# EAGLE design TapuinoMini (EAGLE 6.6.0)
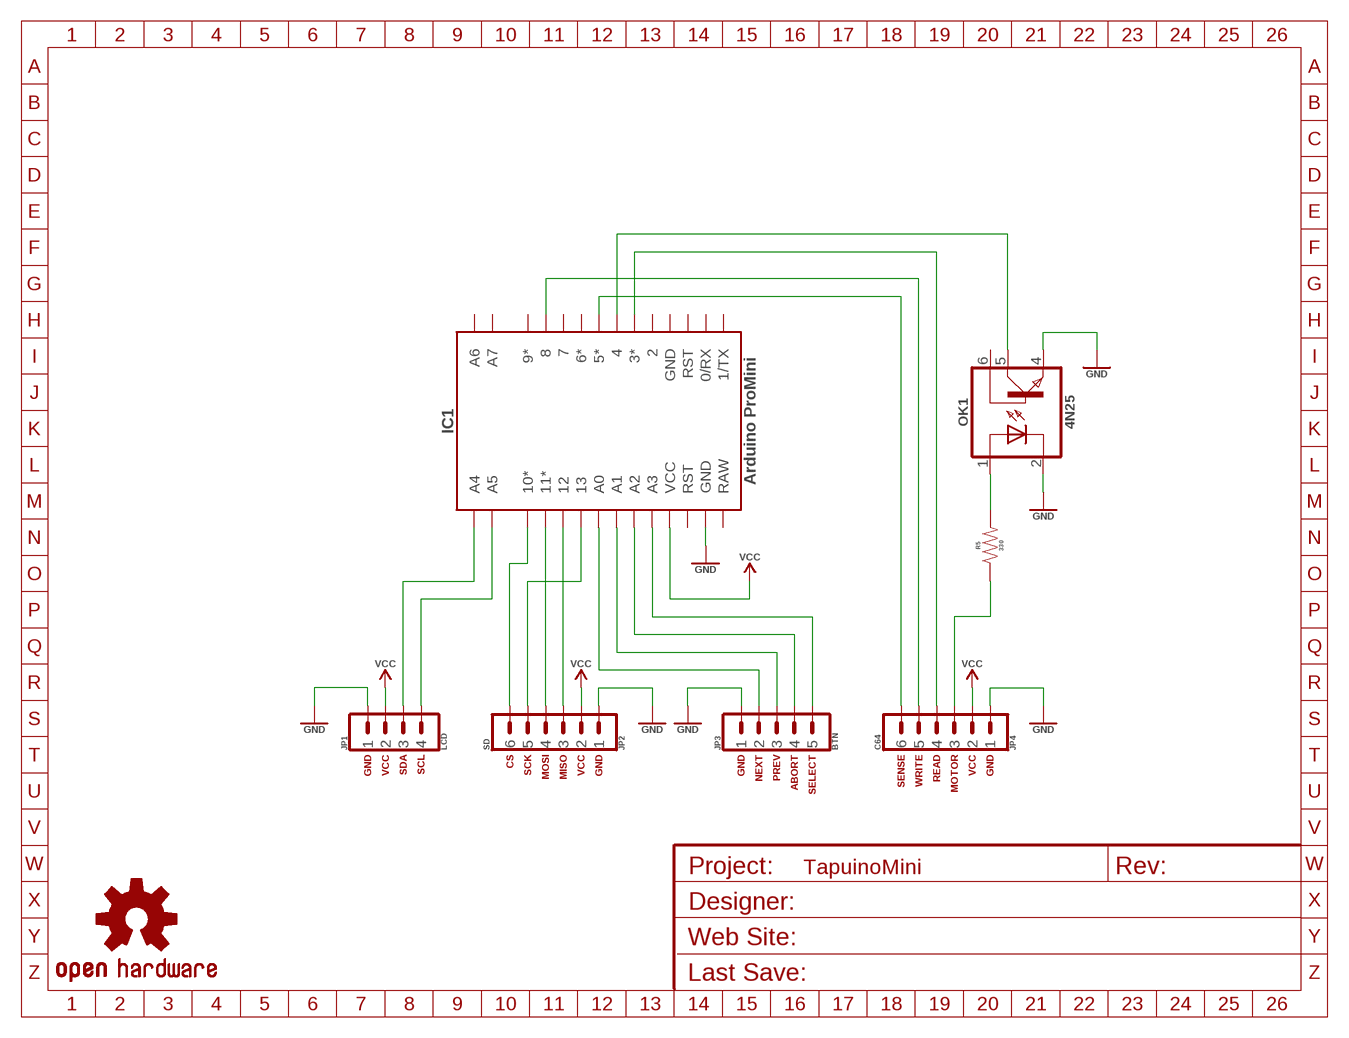
[diagram p0: schematic, sheet 1]
U$1 (FRAME_A5L): DESIGNER: Özay Turay a.k.a Simon/CGTr; REVISION: A 1.01; WEBSITE: http://www.commodore.gen.tr

## Parts
IC1  Arduino ProMini  PROMINI_A  [PROMINI_A]
JP1  LCD  1X04_SQR  [1X04_SQR]
JP2  SD  1X06_SQR  [1X06_SQR]
JP3  BTN  1X05_SQR  [1X05_SQR]
JP4  C64  1X06_SQR  [1X06_SQR]
LOGO1  OSHW-LOGOL  [OSHW-LOGO-L]
OK1  4N25  OPTO_6PIN_4NXX  [DIP06]
R5  330  RESISTOR_PTH_0.3  [RESISTOR_PTH_0.3]

## Nets
ABORT: IC1.A2 JP3.4
CS: IC1.10* JP2.6
GND: IC1.GND@1(GND) JP1.1 JP2.1 JP3.1 JP4.1 OK1.2(CATHODE) OK1.4(EMITTER)
MISO: IC1.12 JP2.3
MOSI: IC1.11* JP2.4
MOTOR1: JP4.3 R5.1
MOTOR2: OK1.1(ANODE) R5.2
MOTOR3: IC1.4 OK1.5(COLLECTOR)
NEXT: IC1.A0 JP3.2
PREV: IC1.A1 JP3.3
READ1: IC1.3* JP4.4
SCK: IC1.13 JP2.5
SCL: IC1.A5 JP1.4
SDA: IC1.A4 JP1.3
SELECT: IC1.A3 JP3.5
SENSE: IC1.5* JP4.6
VCC: IC1.VCC JP1.2 JP2.2 JP4.2
WRITE1: IC1.8 JP4.5
Unconnected: IC1.0/RX IC1.1/TX IC1.2 IC1.6* IC1.7 IC1.9* IC1.A6 IC1.A7 IC1.GND@2(GND) IC1.RAW IC1.RST@1(RST) IC1.RST@2(RST) OK1.6(BASE)

## Notes on the sheet
- GND | VCC | SDA | SCL | CS | SCK | MOSI | MISO | VCC | GND | GND | NEXT | PREV | ABORT | SELECT | SENSE | WRITE | READ | MOTOR | VCC | GND

## Library data of the parts
IC1 = sj_arduino:PROMINI: Arduino Pro Mini
JP1 = sj_connectors:1X04: 1x04 - 0.1" Pin Header
JP2 JP4 = sj_connectors:1X06: 1x06 - 0.1" Pin Header
JP3 = sj_connectors:1X05: 1x05 - 0.1" Pin Header
LOGO1 = sj_temp:OSHW-LOGO: Open Source Hardware Logo This logo indicates the piece of hardware it is found on incorporates a OSHW license and/or adheres to the definition of open source hardware found here: http://freedomdefined.org/OSHW
OK1 = sj_standart:OPTO_6PIN: 6-pin OptoCoupler
R5 = sj_standart:RESISTOR: Resistor

## Board
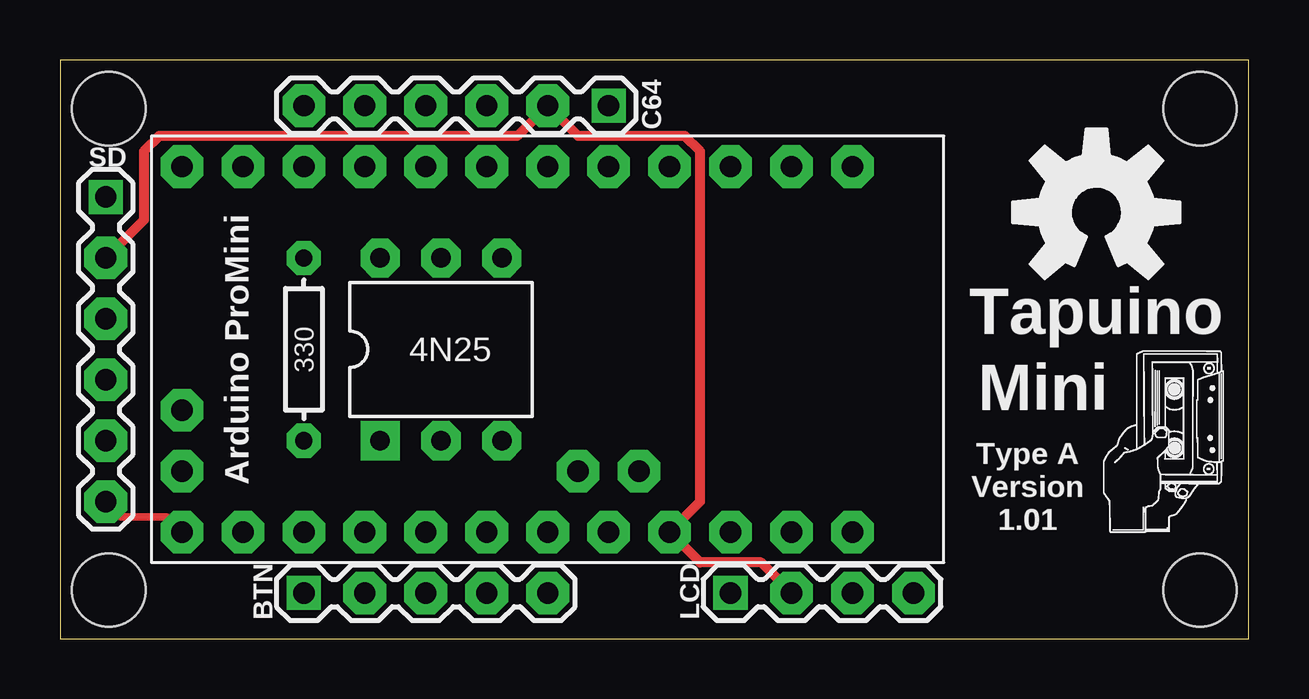
[diagram p1: board, top side]
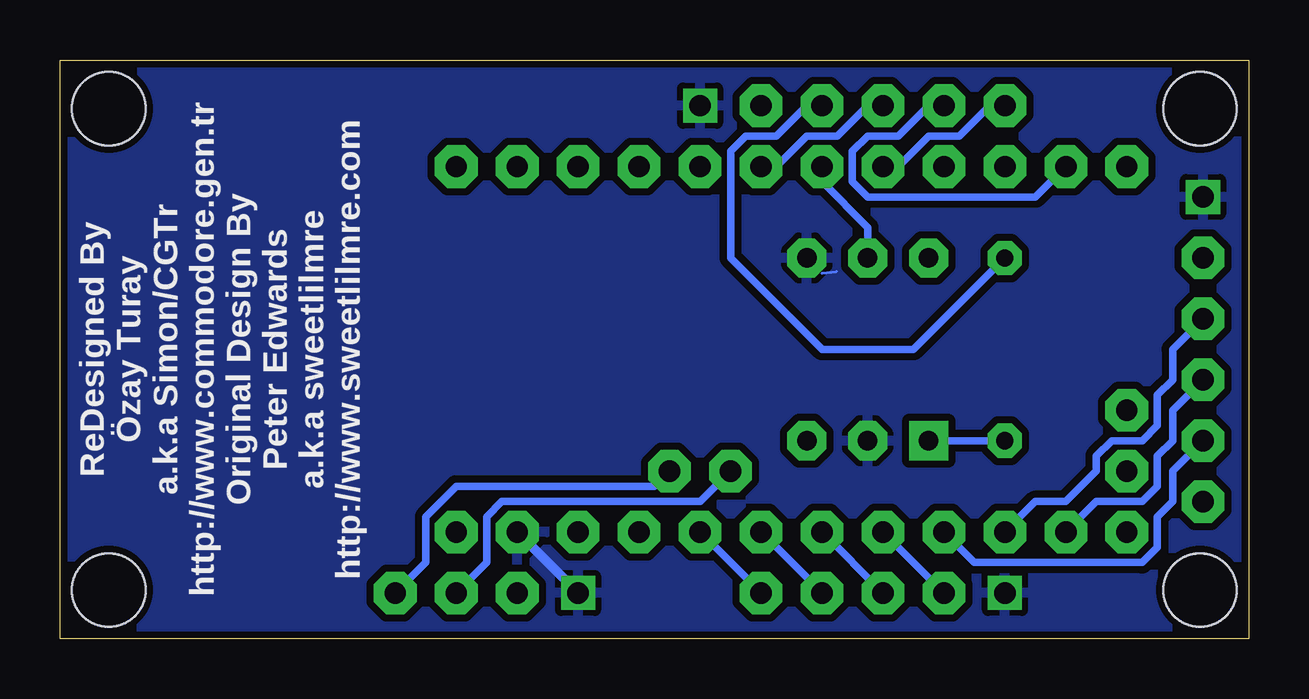
[diagram p2: board, bottom side, seen from below]

Size 49.53 x 24.13 mm. Coordinates in mm from the lower left corner, seen from the top.
Outline: 0,0 49.53,0 49.53,24.13 0,24.13 0,0
Copper layers (1*16): Top 0.035mm / dielectric 1.5mm / Bottom 0.035mm
Design rules "DirtyPCBs": minimum track width 5mil, minimum drill 12mil, track to track 5mil, track to pad 5mil, pad to pad 5mil, via to via 5mil, smd to smd 0mil, copper to edge 10mil, drill to drill 10mil, minimum pad ring 10mil, minimum via ring 6mil, stop-mask expansion 2mil, vias tented up to drill 25mil, thermal gap 10mil
Holes 3.05 mm at 2.03,22.1 2.03,2.03 47.5,2.03 47.5,22.1

### Footprints (pad centres in the part's own frame; a part is rotated, then mirrored left to right if it is on the bottom)
PROMINI_A = drill 0.889 pad 1.778 octagon: 0/RX 10.16,7.62; 1/TX 12.7,7.62; 2 2.54,7.62; 3* 0,7.62; 4 -2.54,7.62; 5* -5.08,7.62; 6* -7.62,7.62; 7 -10.16,7.62; 8 -12.7,7.62; 9* -15.24,7.62; 10* -15.24,-7.62; 11* -12.7,-7.62; 12 -10.16,-7.62; 13 -7.62,-7.62; A0 -5.08,-7.62; A1 -2.54,-7.62; A2 0,-7.62; A3 2.54,-7.62; A4 1.27,-5.08; A5 3.81,-5.08; A6 -15.24,-2.54; A7 -15.24,-5.08; GND@1 10.16,-7.62; GND@2 5.08,7.62; RAW 12.7,-7.62; RST@1 7.62,-7.62; RST@2 7.62,7.62; VCC 5.08,-7.62
1X04_SQR = drill 0.889 pad 1.422 square: 1 0,0 | drill 0.889 pad 1.778 octagon: 2 2.54,0; 3 5.08,0; 4 7.62,0
1X06_SQR = drill 0.889 pad 1.422 square: 1 0,0 | drill 0.889 pad 1.778 octagon: 2 2.54,0; 3 5.08,0; 4 7.62,0; 5 10.16,0; 6 12.7,0
1X05_SQR = drill 0.889 pad 1.422 square: 1 0,0 | drill 0.889 pad 1.778 octagon: 2 2.54,0; 3 5.08,0; 4 7.62,0; 5 10.16,0
DIP06 = drill 0.813 pad 1.626 square: 1 -2.54,-3.81 | drill 0.813 pad 1.626 octagon: 2 0,-3.81; 3 2.54,-3.81; 4 2.54,3.81; 5 0,3.81; 6 -2.54,3.81
RESISTOR_PTH_0.3 = drill 0.711 pad 1.422 octagon: 1 -3.81,0; 2 3.81,0

### Placement (x,y rotation side)
IC1  20.32,12.06 0 top
JP1  27.94,1.91 0 top
JP2  1.91,18.41 270 top
JP3  10.16,1.91 0 top
JP4  22.86,22.23 180 top
LOGO1  43.18,17.78 0 top
OK1  15.88,12.06 0 top
R5  10.16,12.06 270 top

### Tracks (layer width: path | path; a pad name or v marks a point on that pad's centre or on a via)
ABORT
  Bottom 0.305: JP3.4 IC1.A2
CS
  Top 0.305: JP2.6 2.54,5.08 4.45,5.08 IC1.10*
GND
  Bottom 0.127: 17.78,15.24 17.18,15.31
  Bottom 0.406: JP1.1 IC1.GND@1
  pour Bottom (isolate 0.305): 0,24.13 0,0 49.53,0 49.53,24.13
MISO
  Bottom 0.305: JP2.3 3.17,12.06 3.17,10.79 3.81,10.16 3.81,8.89 4.45,8.26 5.71,8.26 6.35,7.62 6.35,6.99 7.62,5.71 8.89,5.71 IC1.12
MOSI
  Bottom 0.305: JP2.4 3.17,9.53 3.17,8.26 3.81,7.62 3.81,6.35 4.45,5.71 6.35,5.71 IC1.11*
MOTOR1
  Bottom 0.305: R5.1 13.97,12.06 17.78,12.06 21.59,15.88 21.59,20.32 20.95,20.95 19.68,20.95 18.41,22.23 JP4.3
MOTOR2
  Bottom 0.305: R5.2 OK1.1
MOTOR3
  Bottom 0.305: OK1.5 15.88,17.14 17.78,19.05 IC1.4
NEXT
  Bottom 0.305: JP3.2 IC1.A0
PREV
  Bottom 0.305: JP3.3 IC1.A1
READ1
  Bottom 0.305: JP4.4 15.88,22.23 17.14,20.95 18.41,20.95 19.68,19.68 IC1.3*
SCK
  Bottom 0.305: JP2.5 3.17,6.99 3.17,5.71 3.81,5.08 3.81,3.81 4.45,3.17 11.43,3.17 IC1.13
SCL
  Bottom 0.305: IC1.A5 24.77,6.35 33.02,6.35 34.29,5.08 34.29,3.17 JP1.4
SDA
  Bottom 0.305: IC1.A4 22.86,5.71 31.11,5.71 31.75,5.08 31.75,3.17 JP1.3
SELECT
  Bottom 0.305: JP3.5 IC1.A3
SENSE
  Bottom 0.305: JP4.6 10.79,22.23 12.06,20.95 13.34,20.95 14.61,19.68 IC1.5*
VCC
  Top 0.406: JP1.2 29.21,3.17 26.67,3.17 IC1.VCC 26.67,5.71 26.67,20.32 26.04,20.95 21.59,20.95 JP4.2 19.05,20.95 4.13,20.95 3.49,20.32 3.49,17.46 JP2.2
WRITE1
  Bottom 0.305: IC1.8 8.89,18.41 15.88,18.41 16.51,19.05 16.51,20.32 15.88,20.95 14.61,20.95 13.34,22.23 JP4.5

### Text on the board
tPlace: Tapuino | Mini | Type A / Version / 1.01
bPlace: ReDesigned By / Özay Turay / a.k.a Simon/CGTr / http://www.commodore.gen.tr / Original Design By / Peter Edwards / a.k.a sweetlilmre / http://www.sweetlilmre.com